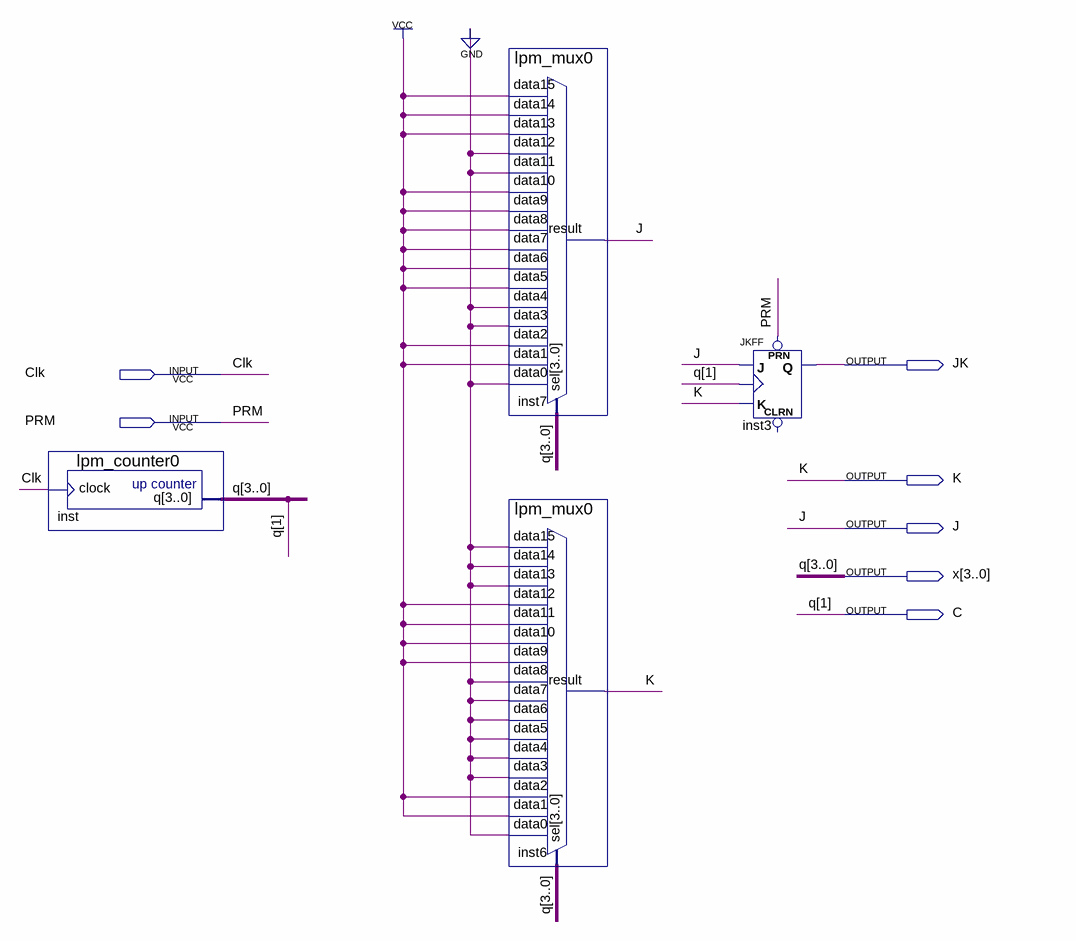
[diagram p0: schematic sheet]
// Quartus schematic JK_trigger.bdf as structural Verilog: 4 symbols, 7 pins
module JK_trigger (
  input  Clk,
  input  PRM,
  output JK,
  output K,
  output J,
  output [3:0] x,
  output C
);

  lpm_counter0 inst (.clock(Clk), .q({x[3:2], C, x[0]}));
  lpm_mux0 inst7 (
    .data15(1'b1), .data14(1'b1), .data13(1'b1), .data12(1'b0), .data11(1'b0), .data10(1'b1), .data9(1'b1),
    .data8(1'b1), .data7(1'b1), .data6(1'b1), .data5(1'b1), .data4(1'b0), .data3(1'b0), .data2(1'b1),
    .data1(1'b1), .data0(1'b0), .sel({x[3:2], C, x[0]}), .result(J));
  lpm_mux0 inst6 (
    .data15(1'b0), .data14(1'b0), .data13(1'b0), .data12(1'b1), .data11(1'b1), .data10(1'b1), .data9(1'b1),
    .data8(1'b0), .data7(1'b0), .data6(1'b0), .data5(1'b0), .data4(1'b0), .data3(1'b0), .data2(1'b1),
    .data1(1'b1), .data0(1'b0), .sel({x[3:2], C, x[0]}), .result(K));
  JKFF inst3 (.PRN(PRM), .K(K), .J(J), .CLK(C), .Q(JK));  // open: CLRN

  assign x[1] = C;

  // Other names for the same wires on the sheet: q[3:0] = {x[3:2], C, x[0]}
endmodule
